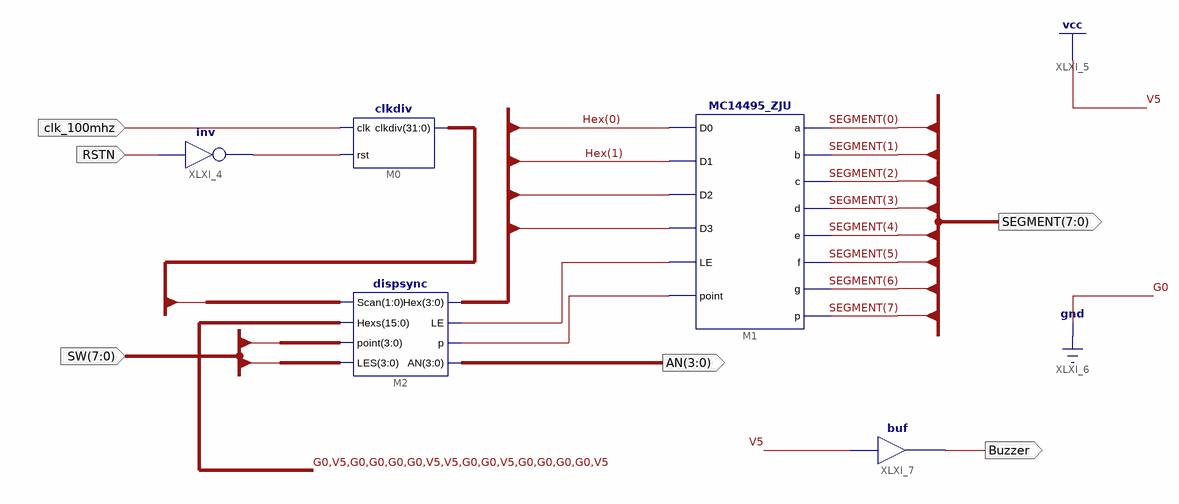
[diagram p0: schematic sheet 1]
// Xilinx ISE schematic Hex427Seg_sch.sch (kintex7) as structural Verilog: 5 symbols, 6 ports
module Hex427Seg_sch (
  input  [7:0] SW,
  input  clk_100mhz,
  input  RSTN,
  output [3:0] AN,
  output [7:0] SEGMENT,
  output Buzzer
);

  wire XLXN_6, XLXN_7, XLXN_12;
  wire [3:0] Hex;
  wire [31:0] clkdiv;

  MC14495_ZJU M1 (
    .D0(Hex[0]), .D1(Hex[1]), .D2(Hex[2]), .D3(Hex[3]), .LE(XLXN_6), .point(XLXN_7), .a(SEGMENT[0]),
    .b(SEGMENT[1]), .c(SEGMENT[2]), .d(SEGMENT[3]), .e(SEGMENT[4]), .f(SEGMENT[5]), .g(SEGMENT[6]),
    .p(SEGMENT[7]));
  clkdiv M0 (.clkdiv(clkdiv), .clk(clk_100mhz), .rst(XLXN_12));
  dispsync M2 (
    .LES(SW[7:4]), .AN(AN), .point(SW[3:0]), .p(XLXN_7), .Hex(Hex), .Hexs(16'b0100001100100001),
    .Scan(clkdiv[18:17]), .LE(XLXN_6));
  not XLXI_4 (XLXN_12, RSTN);
  buf XLXI_7 (Buzzer, 1'b1);
endmodule
